# EAGLE design DA16200_Thing_Plus (EAGLE 9.6.2)
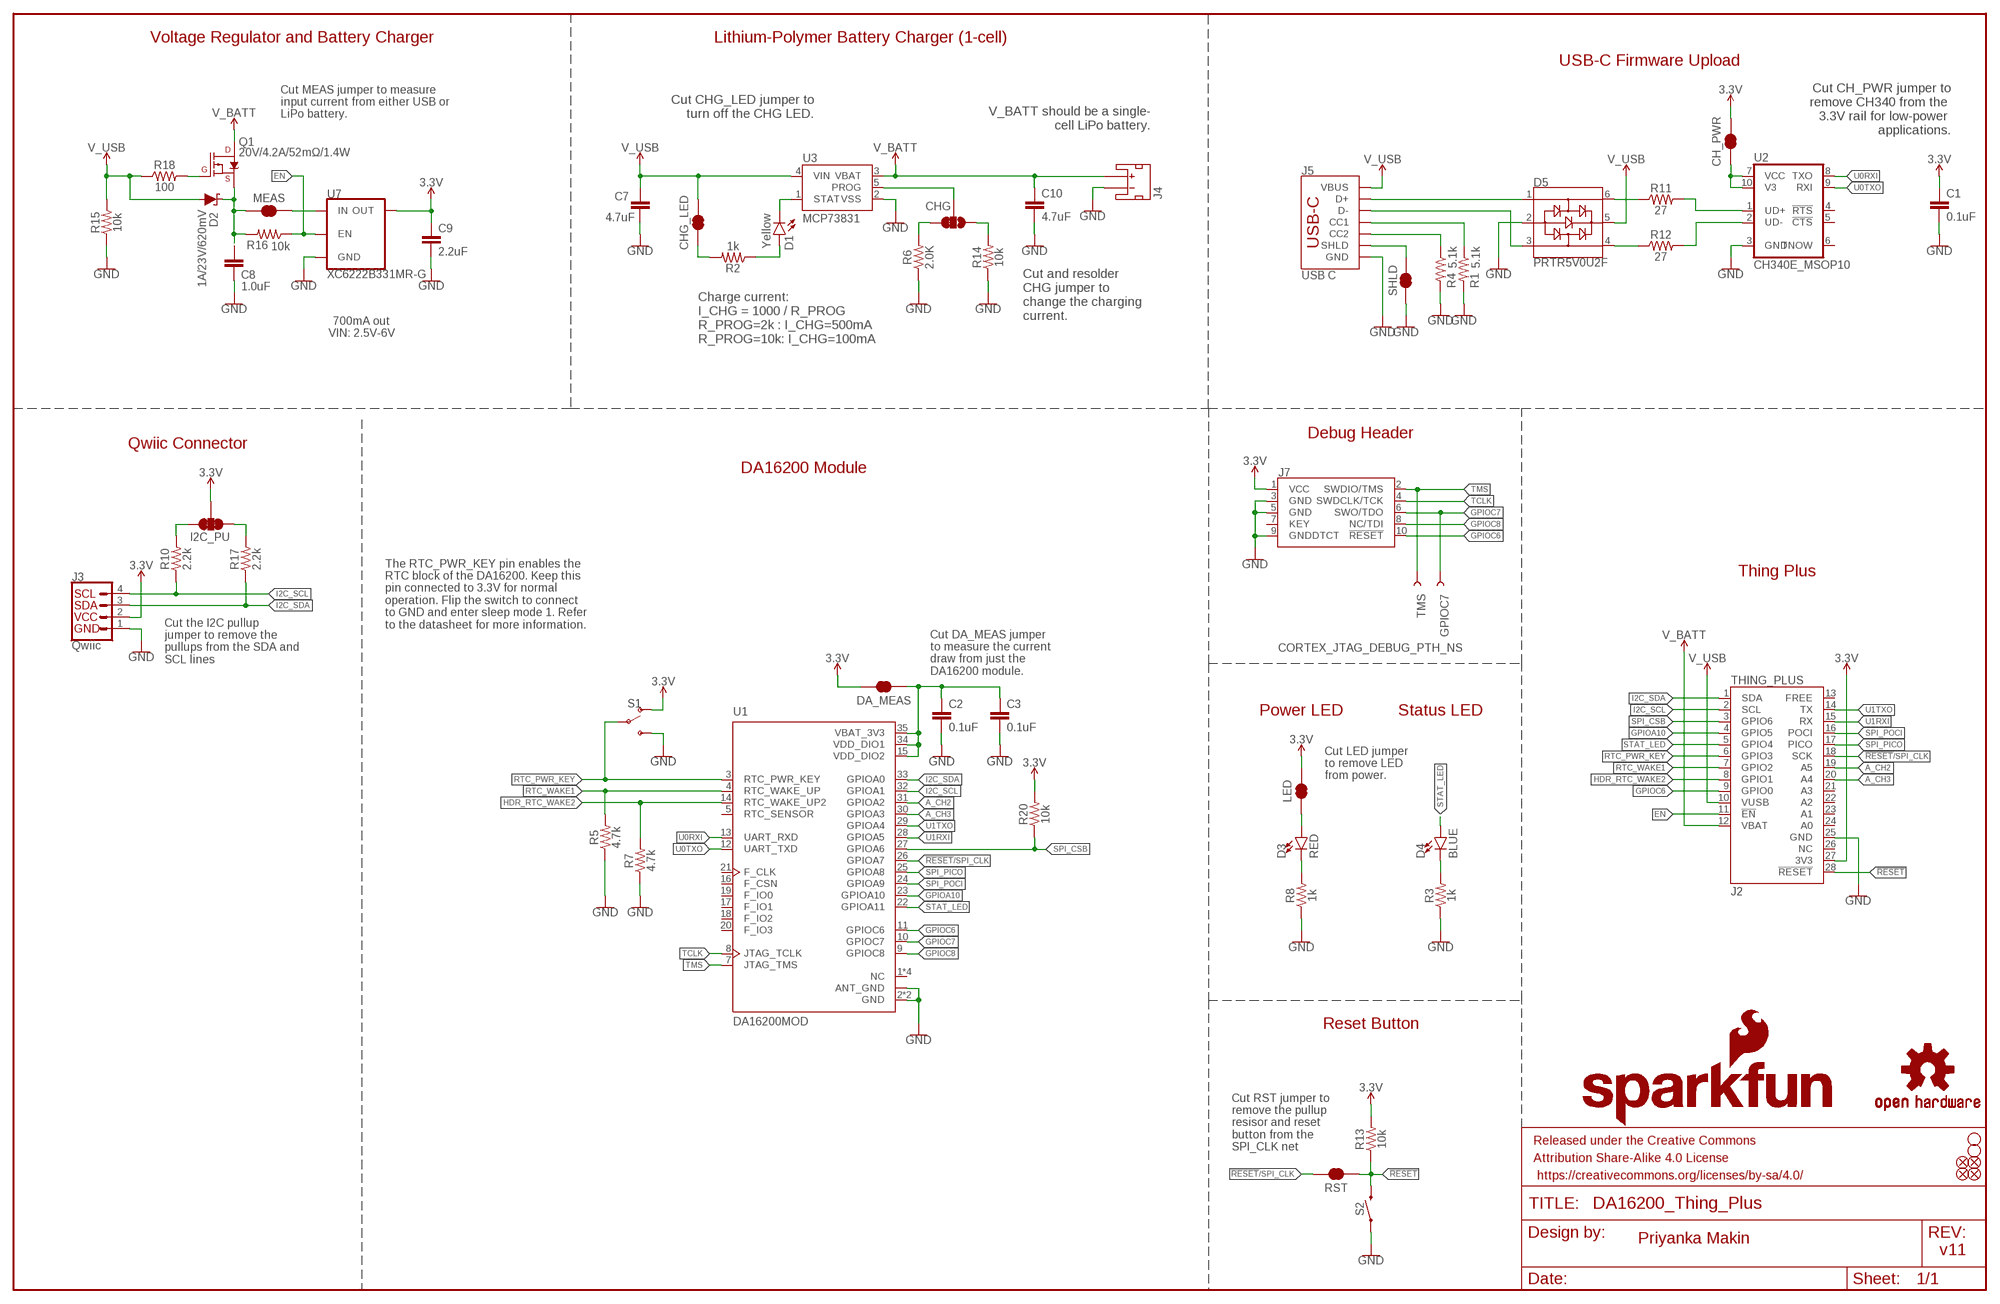
[diagram p0: schematic, sheet 1]

## Parts
C1  0.1uF  0.1UF-0402T-16V-10%  [0402-TIGHT]
C2  0.1uF  0.1UF-0402T-16V-10%  [0402-TIGHT]
C3  0.1uF  0.1UF-0402T-16V-10%  [0402-TIGHT]
C7  4.7uF  4.7UF-0402_TIGHT-6.3V-20%-X5R  [0402-TIGHT]
C8  1.0uF  1.0UF-0402T-16V-10%  [0402-TIGHT]
C9  2.2uF  2.2UF-0402_TIGHT-10V-10%-X5R  [0402-TIGHT]
C10  4.7uF  4.7UF-0402_TIGHT-6.3V-20%-X5R  [0402-TIGHT]
CH_PWR  JUMPER-SMT_2_NC_TRACE_SILK  [SMT-JUMPER_2_NC_TRACE_SILK]
CHG  JUMPER-SMT_3_1-NC_TRACE_SILK  [SMT-JUMPER_3_1-NC_TRACE_SILK]
CHG_LED  JUMPER-SMT_2_NC_TRACE_SILK  [SMT-JUMPER_2_NC_TRACE_SILK]
D1  Yellow  LED-YELLOW0603  [LED-0603]
D2  1A/23V/620mV  DIODE-SCHOTTKY-BAT20J  [SOD-323]
D3  RED  LED-RED0603  [LED-0603]
D4  BLUE  LED-BLUE0603  [LED-0603]
D5  PRTR5V0U2F  [SOT886]
DA_MEAS  JUMPER-SMT_2_NC_TRACE_SILK  [SMT-JUMPER_2_NC_TRACE_SILK]
FD1  FIDUCIALUFIDUCIAL  [FIDUCIAL-MICRO]
FD2  FIDUCIALUFIDUCIAL  [FIDUCIAL-MICRO]
FD3  FIDUCIALUFIDUCIAL  [FIDUCIAL-MICRO]
FD4  FIDUCIALUFIDUCIAL  [FIDUCIAL-MICRO]
FRAME1  FRAME-LEDGER  [CREATIVE_COMMONS]
GPIOC7  TEST-POINT3  [PAD.03X.03]
H3  STAND-OFF  [STAND-OFF]
H4  STAND-OFF  [STAND-OFF]
I2C_PU  JUMPER-SMT_3_2-NC_TRACE_SILK  [SMT-JUMPER_3_2-NC_TRACE_SILK]
J2  THING_PLUS  [THING_PLUS]
J3  Qwiic  QWIIC_CONNECTORJS-1MM  [JST04_1MM_RA]
J4  JST_2MM_MALE  [JST-2-SMD]
J5  USB C  USB_C_4-LAYER-ISOLATED  [USB-C-16P-4LAYER-ISOLATED]
J7  CORTEX_JTAG_DEBUG_PTH_NS  [2X5-PTH-1.27MM-NO_SILK]
LED  JUMPER-SMT_2_NC_TRACE_SILK  [SMT-JUMPER_2_NC_TRACE_SILK]
LOGO1  OSHW-LOGOS  [OSHW-LOGO-S]
LOGO2  SFE_LOGO_NAME_FLAME.1_INCH  [SFE_LOGO_NAME_FLAME_.1]
MEAS  JUMPER-COMBO_2_NC_TRACE  [COMBO-JUMPER_2_NC_TRACE]
Q1  20V/4.2A/52mΩ/1.4W  MOSFET_PCH-DMG2305UX-7  [SOT23-3]
R1  5.1k  5.1KOHM-0402T-1/16W-1%  [0402-TIGHT]
R2  1k  1KOHM-0402T-1/16W-1%  [0402-TIGHT]
R3  1k  1KOHM-0402T-1/16W-1%  [0402-TIGHT]
R4  5.1k  5.1KOHM-0402T-1/16W-1%  [0402-TIGHT]
R5  4.7k  4.7KOHM-0402T-1/16W-1%  [0402-TIGHT]
R6  2.0K  2.0KOHM-0402T-1/16W-1%  [0402-TIGHT]
R7  4.7k  4.7KOHM-0402T-1/16W-1%  [0402-TIGHT]
R8  1k  1KOHM-0402T-1/16W-1%  [0402-TIGHT]
R10  2.2k  2.2KOHM-0402T-1/16W-1%  [0402-TIGHT]
R11  27  27OHM  [0402-TIGHT]
R12  27  27OHM  [0402-TIGHT]
R13  10k  10KOHM-0402T-1/16W-1%  [0402-TIGHT]
R14  10k  10KOHM-0402T-1/16W-1%  [0402-TIGHT]
R15  10k  10KOHM-0402T-1/16W-1%  [0402-TIGHT]
R16  10k  10KOHM-0402T-1/16W-1%  [0402-TIGHT]
R17  2.2k  2.2KOHM-0402T-1/16W-1%  [0402-TIGHT]
R18  100  100OHM-0402-TIGHT-1/16W-1%  [0402-TIGHT]
R20  10k  10KOHM-0402T-1/16W-1%  [0402-TIGHT]
RST  JUMPER-SMT_2_NC_TRACE_SILK  [SMT-JUMPER_2_NC_TRACE_SILK]
S1  SWITCH-SPDT-SMD-AYZ0202  [SWITCH_DPDT_SMD_AYZ0202]
S2  MOMENTARY-SWITCH-SPST-SMD-5.2MM-TALL  [TACTILE_SWITCH_SMD_5.2MM]
SHLD  JUMPER-SMT_2_NC_TRACE_SILK  [SMT-JUMPER_2_NC_TRACE_SILK]
TMS  TEST-POINT3  [PAD.03X.03]
U1  DA16200MOD  DA16200MOD-AAC4WA32  [XCVR_DA16200MOD-AAC4WA32]
U2  CH340E_MSOP10  [MSOP10]
U3  MCP73831  [SOT23-5]
U7  XC6222B331MR-G  [SOT23-5]

## Nets
3.3V: C1.1 C9.1 CH_PWR.2 DA_MEAS.2 I2C_PU.2 J2.27(3V3) J3.2 J7.1(VCC) LED.2 R13.2 R20.2 S1.1(O) U7.5(OUT)
!RESET!: J2.28(!RESET) R13.1 RST.1 S2.3
!RESET!/SPI_CLK: J2.18(SCK) RST.2 U1.26(GPIOA7)
A_CH2: J2.19(A5) U1.31(GPIOA2)
A_CH3: J2.20(A4) U1.30(GPIOA3)
EN: J2.11(!EN) R16.1 U7.3(EN)
GND: C1.2 C2.2 C3.2 C7.2 C8.2 C9.2 C10.2 D5.2 J2.25(GND) J3.1 J4.1(-) J5.GND J5.GND2(GND) J7.3(GND) J7.5(GND) J7.9(GNDDTCT) R1.2 R3.1 R4.2 R5.1 R6.1 R7.1 R8.1 R14.1 R15.1 S1.3(S) S2.1 SHLD.1 U1.2(GND) U1.ANT_GND U1.GND U2.3(GND) U3.2(VSS) U7.2(GND)
GPIOA10: J2.4(GPIO5) U1.23(GPIOA10)
GPIOC6: J2.9(GPIO0) J7.10(!RESET) U1.11(GPIOC6)
GPIOC7: GPIOC7.1 J7.6(SWO/TDO) U1.10(GPIOC7)
GPIOC8: J7.8(NC/TDI) U1.9(GPIOC8)
HDR_RTC_WAKE2: J2.8(GPIO1) R7.2 U1.14(RTC_WAKE_UP2)
I2C_SCL: J2.2(SCL) J3.4 R10.1 U1.32(GPIOA1)
I2C_SDA: J2.1(SDA) J3.3 R17.1 U1.33(GPIOA0)
N$1: D4.C R3.2
N$2: I2C_PU.3 R10.2
N$3: I2C_PU.1 R17.2
N$4: D3.A LED.1
N$5: D5.1 J5.A6(D+) J5.B6(D+)
N$6: D5.3 J5.A7(D-) J5.B7(D-)
N$7: D3.C R8.2
N$8: C2.1 C3.1 DA_MEAS.1 U1.15(VDD_DIO2) U1.34(VDD_DIO1) U1.35(VBAT_3V3)
N$9: D1.C U3.1(STAT)
N$10: CHG.3 R6.2
N$11: J5.A5(CC1) R1.1
N$12: J5.B5(CC2) R4.1
N$13: D5.6 R11.1
N$14: CHG.2 U3.5(PROG)
N$15: C8.1 D2.C MEAS.1 MEAS.3 Q1.2(S) R16.2
N$16: D5.4 R12.1
N$17: D1.A R2.1
N$18: R11.2 U2.1(UD+)
N$19: R12.2 U2.2(UD-)
N$20: CHG.1 R14.2
N$21: Q1.1(G) R18.2
N$22: MEAS.2 MEAS.4 U7.1(IN)
N$23: CHG_LED.1 R2.2
N$24: J5.SHLD1(SHLD) J5.SHLD2(SHLD) J5.SHLD3(SHLD) J5.SHLD4(SHLD) J5.SHLD5(SHLD) J5.SHLD6(SHLD) J5.SHLD7(SHLD) J5.SHLD8(SHLD) SHLD.2
N$26: CH_PWR.1 U2.7(VCC) U2.10(V3)
RTC_PWR_KEY: J2.6(GPIO3) S1.2(P) U1.3(RTC_PWR_KEY)
RTC_WAKE1: J2.7(GPIO2) R5.2 U1.4(RTC_WAKE_UP)
SPI_CSB: J2.3(GPIO6) R20.1 U1.27(GPIOA6)
SPI_PICO: J2.17(PICO) U1.25(GPIOA8)
SPI_POCI: J2.16(POCI) U1.24(GPIOA9)
STAT_LED: D4.A J2.5(GPIO4) U1.22(GPIOA11)
TCLK: J7.4(SWDCLK/TCK) U1.8(JTAG_TCLK)
TMS: J7.2(SWDIO/TMS) TMS.1 U1.7(JTAG_TMS)
U0RXI: U1.13(UART_RXD) U2.8(TXO)
U0TXO: U1.12(UART_TXD) U2.9(RXI)
U1RXI: J2.15(RX) U1.28(GPIOA5)
U1TXO: J2.14(TX) U1.29(GPIOA4)
V_BATT: C10.1 J2.12(VBAT) J4.2(+) Q1.3(D) U3.3(VBAT)
V_USB: C7.1 CHG_LED.2 D2.A D5.5 J2.10(VUSB) J5.VBUS1(VBUS) J5.VBUS2(VBUS) R15.2 R18.1 U3.4(VIN)
Unconnected: J2.13(FREE) J2.21(A3) J2.22(A2) J2.23(A1) J2.24(A0) J2.26(NC) J4.NC1(PAD1) J4.NC2(PAD2) J7.7(KEY) U1.1(NC) U1.5(RTC_SENSOR) U1.6(NC) U1.16(F_CSN) U1.17(F_IO1) U1.18(F_IO2) U1.19(F_IO0) U1.20(F_IO3) U1.21(F_CLK) U1.36(NC) U1.37(NC) U2.4(!RTS) U2.5(!CTS) U2.6(TNOW)

## Notes on the sheet
- Voltage Regulator and Battery Charger | Lithium-Polymer Battery Charger (1-cell)
- USB-C Firmware Upload
- Cut CH_PWR jumper to
  remove CH340 from the 
  3.3V rail for low-power 
  applications.
- Cut CHG_LED jumper to
  turn off the CHG LED.
- V_BATT should be a single-
  cell LiPo battery.
- Cut MEAS jumper to measure
  input current from either USB or 
  LiPo battery.
- Cut and resolder
  CHG jumper to 
  change the charging
  current.
- Charge current:
  I_CHG = 1000 / R_PROG
  R_PROG=2k : I_CHG=500mA
  R_PROG=10k: I_CHG=100mA
- 700mA out
  VIN: 2.5V-6V
- Debug Header
- Qwiic Connector
- DA16200 Module
- Thing Plus
- The RTC_PWR_KEY pin enables the 
  RTC block of the DA16200. Keep this 
  pin connected to 3.3V for normal 
  operation. Flip the switch to connect 
  to GND and enter sleep mode 1. Refer 
  to the datasheet for more information.
- Cut the I2C pullup 
  jumper to remove the 
  pullups from the SDA and 
  SCL lines
- Cut DA_MEAS jumper
  to measure the current
  draw from just the
  DA16200 module.
- Power LED | Status LED
- Cut LED jumper
  to remove LED
  from power.
- Reset Button
- Cut RST jumper to
  remove the pullup
  resisor and reset
  button from the
  SPI_CLK net
- Priyanka Makin
- v11

## Library data of the parts
C1-C3 = SparkFun-Capacitors:0.1UF: 0.1µF ceramic capacitors A capacitor is a passive two-terminal electrical component used to store electrical energy temporarily in an electric field.; PROD_ID: CAP-12416
C7 C10 = SparkFun-Capacitors:4.7UF: 4.7µF ceramic capacitors A capacitor is a passive two-terminal electrical component used to store electrical energy temporarily in an electric field.; PROD_ID: CAP-14240
C8 = SparkFun-Capacitors:1.0UF: 1µF ceramic capacitors A capacitor is a passive two-terminal electrical component used to store electrical energy temporarily in an electric field.; PROD_ID: CAP-12417
C9 = SparkFun-Capacitors:2.2UF: 2.2µF ceramic capacitors A capacitor is a passive two-terminal electrical component used to store electrical energy temporarily in an electric field.; PROD_ID: CAP-14232
CH_PWR CHG_LED DA_MEAS LED RST SHLD = SparkFun-Jumpers:JUMPER-SMT_2_NC_TRACE: Normally closed trace jumper This jumper has a trace between two pads so it's normally closed (NC). Use a razor knife to open the connection. For best results follow the IPC guidelines for cutting traces: Cutout at least 0.063 mm (0.005 in). Remove all loose material to clean up the cut area. Seal the cut with an approved epoxy. Reapply solder to reclose the connection.
CHG = SparkFun-Jumpers:JUMPER-SMT_3_1-NC_TRACE: Normally closed trace jumper (1 of 2 connections) This jumper has a trace between two pads so it's normally closed (NC). The other connection is normally open (NO). Use a razor knife to open the connection. For best results follow the IPC guidelines for cutting traces: Cutout at least 0.063 mm (0.005 in). Remove all loose material to clean up the cut area. Seal the cut with an approved epoxy. Reapply solder to reclose the connection, or to close the NO connection.
D1 = SparkFun-LED:LED-YELLOW: Yellow SMD LED Used in manufacturing several products at SparkFun. Packages: 0603 - SMD 0603 package[Product Link] <http://www.kingbrightusa.com/product.asp?catalog_name=LED&product_id=APT1608SYCK> 0603 -SMART - SMART SMD 0603 package (more efficient/more expensive) [Product Link] <http://www.osram-os.com/osram_os/en/products/product-catalog/led-light-emitting-diodes/smartled-0603/ly-l29k/index.jsp> LilyPad - SMD1206 package[Product Datasheet] <https://www.sparkfun.com/datasheets/DevTools/LilyPad/Q150YUS4.pdf> SparkFun Products: Blynk Board <https://www.sparkfun.com/products/13794> IOIO-OTG <https://www.sparkfun.com/products/13613> XBee Explorer Serial <https://www.sparkfun.com/products/13225>; PROD_ID: DIO-09003
D2 = SparkFun-DiscreteSemi:DIODE-SCHOTTKY: Schottky diode A Schottky diode is a semiconductor diode which has a low forward voltage drop and a very fast switching action.; PROD_ID: DIO-11623
D3 = SparkFun-LED:LED-RED: Red SMD LED Used in manufacturing of most products at SparkFun Packages: 0603 - SMD 0603 package [Product Link] <http://docs.avagotech.com/docs/AV02-0551EN> 0603 SMART - SMD 0603 SMART package ( more efficient and expensive)[Product Link] <http://www.osram-os.com/Graphics/XPic2/00077099_0.pdf> 1206 - SMD1206 package [Product Link] <https://www.sparkfun.com/datasheets/DevTools/LilyPad/Q150OVS4.pdff> SparkFun Products: Pro Mini 328 -5V <https://www.sparkfun.com/products/821> RedBoard <https://www.sparkfun.com/products/12757> IOIO-OTG <https://www.sparkfun.com/products/13613>; PROD_ID: DIO-00819
D4 = SparkFun-LED:LED-BLUE: Blue SMD LED Used in manufacturing of various products at SparkFun Packages: 0603 - SMD 0603 package [Product Link] <http://www.digikey.com/product-detail/en/SMLE12BC7TT86/511-1589-2-ND/1641808> 1206 - SMD1206 package [Product Link] <http://www.digikey.com/product-detail/en/lite-on-inc/LTST-C150TBKT/160-1643-1-ND/573584> SparkFun Products: ESP8266 Thing-Dev Board <https://www.sparkfun.com/products/13711> RedBoard <https://www.sparkfun.com/products/12757>; PROD_ID: DIO-08575
D5 = SparkFun-IC-Power:PRTR5V0U2: A small ESD protection device. Most commonly used on USB D+/D- signals to protect large, expensive, or especially sensitive USB enabled devices.; PROD_ID: DIO-14084
FD1-FD4 = SparkFun-Aesthetics:FIDUCIAL: Fiducial Alignment Points Point-of-reference for pick-and-place machines and other optical instruments.
FRAME1 = SparkFun-Aesthetics:FRAME-LEDGER: Schematic Frame - Ledger Standard 11x14 US Ledger frame
GPIOC7 TMS = SparkFun-Connectors:TEST-POINT: SparkFun Test Points Bare copper test points for troubleshooting or In-Circuit-Testing. These are used by our Production team for verifying production board runs using pogo-pins on test beds. SparkFun Products: SparkFun LSM9DS1 Breakout <https://www.sparkfun.com/products/13284> SparkFun PSOC <https://www.sparkfun.com/products/13714> SparkFun Load Cell Amplifier <https://www.sparkfun.com/products/13879>
H3 H4 = SparkFun-Hardware:STAND-OFF: Stand Off Drill holes for mechanically mounting via screws, standoffs, etc. Note: Use the keepout ring to avoid running the screw head into surrounding components. Variant Overviews STAND-OFF - Mechanical footprint for a #4 phillips button head screw. STAND-OFF-TIGHT - Mechanical footprint for a #4 phillips button head screw, Example SparkFun Products Screw - Phillips Head (1/4", 4-40, 10 pack) (PRT-10453) Screw - Phillips Head (1/2", 4-40, 10 pack) (PRT-10452) Screw - Phillips Head (3/4", 4-40, 10 pack) (PRT-10451) Screw - Phillips Head (1", 4-40, 10 pack) (PRT-10450)
I2C_PU = SparkFun-Jumpers:JUMPER-SMT_3_2-NC_TRACE: Normally closed trace jumper (2 of 2 connections) This jumper has a trace between all three pads so they are normally closed (NC). Use a razor knife to open the connection(s). For best results follow the IPC guidelines for cutting traces: Cutout at least 0.063 mm (0.005 in). Remove all loose material to clean up the cut area. Seal the cut with an approved epoxy. Reapply solder to reclose the connection(s).
J2 = SparkFun-Boards:THING_PLUS
J3 = SparkFun-Connectors:QWIIC_CONNECTOR: SparkFun I2C Standard Qwiic Connector An SMD 1mm pitch JST connector makes it easy and quick (get it? Qwiic?) to connect I2C devices to each other. The Qwiic system <http://www.sparkfun.com/qwiic> enables fast and solderless connection between popular platforms and various sensors and actuators. We carry 200mm <https://www.sparkfun.com/products/14204>, 100mm <https://www.sparkfun.com/products/14205>, 50mm <https://www.sparkfun.com/products/14206>, and breadboard friendly <https://www.sparkfun.com/products/14207> Qwiic cables. We also offer 10 pcs strips <https://www.sparkfun.com/products/14323> the SMD connectors.; PROD_ID: CONN-13694; VALUE: QWIIC_RIGHT_ANGLE
J4 = SparkFun-Connectors:JST_2MM_MALE: JST 2MM MALE RA CONNECTOR Two pin, compact surface mount connector. Commonly used as a battery input connection point. We really like the solid locking feeling and high current rating on these small connectors. We use these all the time as battery connectors. Mates to single-cell LiPo batteries. Here is the connector we sell at SparkFun: JST Right Angle Connector - White (PRT-08612) Datasheet It was used on these SparkFun products: SparkFun MOSFET Power Controller (PRT-11214) SparkFun Battery Babysitter - LiPo Battery Manager (PRT-13777) And many, many others that required a lipo battery connection.; PROD_ID: CONN-11443; SF_ID: PRT-08612
J5 = SparkFun-Connectors:USB_C: USB Type C 16Pin Connector Super Speed pins not available on the 16-pin purely SMD connector so this part is best for USB 2.0 implementations. D1 and D2 are tied together enabling D+/- no matter which way the cable is plugged into the connector. The two channel configuration pins (CC1/2) are exposed. These are normally connected to ground via 5.1k resistors but can be reconfigured for high current/high power applications. **4-LAYER BOARD WARNING!!** If designing 4-layer board, make sure to select the variant _4-LAYER-ISOLATED. The linked footprint (USB-C-16-4LAYER-ISOLATED) includes some very necessary cutout polygons in the inner layers (2 and 15). This prevents the PTH mounting shield legs on the USB connector from electrically connecting any other polygons on the inner layers (usually VCC and GND).; PROD_ID: CONN-14122; VALUE: USB Female Type C Connector
J7 = SparkFun-Connectors:CORTEX_JTAG_DEBUG: Cortex Debug Connector - 10 pin Supports JTAG debug, Serial Wire debug, and Serial Wire Viewer. PTH and SMD connector options available. General Connector Information <http://infocenter.arm.com/help/topic/com.arm.doc.faqs/attached/13634/cortex_debug_connectors.pdf> Products: PTH Connector <http://www.digikey.com/product-detail/en/cnc-tech/3220-10-0100-00/1175-1627-ND/3883661> -via Digi-Key SparkFun PSoc <https://www.sparkfun.com/products/13229> SparkFun T <https://www.sparkfun.com/products/13810>
LOGO1 = SparkFun-Aesthetics:OSHW-LOGO: Open-Source Hardware (OSHW) Logo This logo indicates the piece of hardware it is found on incorporates a OSHW license and/or adheres to the definition of open source hardware found here: http://freedomdefined.org/OSHW
LOGO2 = SparkFun-Aesthetics:SFE_LOGO_NAME_FLAME: SparkFun Font Logo w/ Flame This is the SparkFun full logo. The logo on the schematic will always be the same size; the package variant is the height of the flame part of the logo. Default layer for the logo on the board is tSilk.
MEAS = SparkFun-Jumpers:JUMPER-COMBO_2_NC_TRACE
Q1 = SparkFun-DiscreteSemi:MOSFET_PCH: P-channel MOSFETs Voltage controlled devices that allow control of high current outputs. SparkFun Products: SparkFun ESP32 Thing <https://www.sparkfun.com/products/13907> SparkFun ESP8266 Thing <https://www.sparkfun.com/products/13231> SparkFun Pi Servo HAT V2 <https://www.sparkfun.com/products/15316> DMG2305UX-7 (20V/4.2A/SOT23-3); PROD_ID: TRANS-14388
R1 R4 = SparkFun-Resistors:5.1KOHM; PROD_ID: RES-14340
R2 R3 R8 = SparkFun-Resistors:1KOHM: 1kΩ resistor A resistor is a passive two-terminal electrical component that implements electrical resistance as a circuit element. Resistors act to reduce current flow, and, at the same time, act to lower voltage levels within circuits. - Wikipedia; PROD_ID: RES-14342
R5 R7 = SparkFun-Resistors:4.7KOHM: 4.7kΩ resistor A resistor is a passive two-terminal electrical component that implements electrical resistance as a circuit element. Resistors act to reduce current flow, and, at the same time, act to lower voltage levels within circuits. - Wikipedia; PROD_ID: RES-15343
R6 = SparkFun-Resistors:2.0KOHM: 2kΩ resistor A resistor is a passive two-terminal electrical component that implements electrical resistance as a circuit element. Resistors act to reduce current flow, and, at the same time, act to lower voltage levels within circuits. - Wikipedia; PROD_ID: RES-15406
R10 R17 = SparkFun-Resistors:2.2KOHM: 2.2kΩ resistor A resistor is a passive two-terminal electrical component that implements electrical resistance as a circuit element. Resistors act to reduce current flow, and, at the same time, act to lower voltage levels within circuits. - Wikipedia; PROD_ID: RES-14341
R11 R12 = SparkFun-Resistors:27OHM: 27Ω resistor A resistor is a passive two-terminal electrical component that implements electrical resistance as a circuit element. Resistors act to reduce current flow, and, at the same time, act to lower voltage levels within circuits. - Wikipedia; PROD_ID: RES-15238
R13-R16 R20 = SparkFun-Resistors:10KOHM: 10kΩ resistor A resistor is a passive two-terminal electrical component that implements electrical resistance as a circuit element. Resistors act to reduce current flow, and, at the same time, act to lower voltage levels within circuits. - Wikipedia; PROD_ID: RES-14241
R18 = SparkFun-Resistors:100OHM: 100Ω resistor A resistor is a passive two-terminal electrical component that implements electrical resistance as a circuit element. Resistors act to reduce current flow, and, at the same time, act to lower voltage levels within circuits. - Wikipedia; PROD_ID: RES-14962
S1 = SparkFun-Switches:SWITCH-SPDT: Single Pole, Double Throw (SPDT) Switch Single-pole, double-throw (SPDT) switch. Variant Overview SMD-AYZ0202 Surface Mount DPDT Switch (COM-00597) Used on e.g. LilyPad Arduino USB - ATmega32U4 Board PTH-11.6X4.0MM SPDT Mini Power Switch (COM-00102) Used on e.g. SparkFun Simon Says - Through-Hole Soldering Kit (KIT-10547) PTH-11.6X4.0MM-KIT KIT version of SPDT Mini Power Switch - Simplifies soldering by removing tStop of switch pins - only one side can be soldered. PTH-11.6X4.0MM-LOCK LOCK version of SPDT Mini Power Switch - Offset pins hold switch in place for easier soldering. SMD-RIGHT-ANGLE Surface Mount Right Angle Switch (COM-10860) Used on e.g. SparkFun ESP8266 Thing; PROD_ID: SWCH-08179; SF_ID: COM-00597
S2 = SparkFun-Switches:MOMENTARY-SWITCH-SPST: Momentary Switch (Pushbutton) - SPST Normally-open (NO) SPST momentary switches (buttons, pushbuttons). Variants PTH-12MM - 12mm square, through-hole Momentary Pushbutton Switch - 12mm Square (COM-09190) PTH-6.0MM, PTH-6.0MM-KIT - 6.0mm square, through-hole Mini Pushbutton Switch (COM-00097) KIT package intended for soldering kit's - only one side of pads' copper is exposed. PTH-RIGHT-ANGLE-KIT - Right-angle, through-hole Right Angle Tactile Button - Used on SparkFun BigTime Watch Kit SMD-12MM - 12mm square, surface-mount Tactile Button - SMD (12mm) (COM-12993) Used on SparkFun PicoBoard SMD-4.5MM - 4.5mm Square Trackball Switch Used on SparkFun Blackberry Trackballer Breakout SMD-4.6MMX2.8MM - 4.60mm x 2.80mm, surface mount Used on SparkFun Pro Micro - RP2040 SMD-5.2MM, SMD-5.2-REDUNDANT - 5.2mm square, surface-mount Mini Pushbutton Switch - SMD (COM-08720) Used on Arduino Pro Mini REDUNDANT package connects both switch circuits together SMD-6.0X3.5MM - 6.0 x 3.5mm, surface mount Momentary Reset Switch SMD (COM-08229) SMD-6.2MM-TALL - 6.2mm square, surface mount Tactile Button - SMD (6mm) Used on SparkFun Digital Sandbox SMD-RIGHT-ANGLE - Right-angle, surface mount Used on SparkFun Block for Intel® Edison - Arduino; PROD_ID: SWCH-14139
U1 = SparkFun-RF:DA16200MOD-AAC4WA32: Check prices; PROD_ID: IC-16179
U2 = SparkFun-IC-Comms:CH340E; PROD_ID: IC-14135
U3 = SparkFun-IC-Power:MCP73831: MCP73831T Li-Ion, Li-Pol Controller Miniature single cell, fully integrated Li-Ion, Li-polymer charge management controller Datasheet <http://ww1.microchip.com/downloads/en/DeviceDoc/20001984g.pdf> SparkFun Products: SparkFun ESP32 Thing <https://www.sparkfun.com/products/13907> SparkFun 9DoF Razor IMU M0 <https://www.sparkfun.com/products/14001>; PROD_ID: IC-09995
U7 = SparkFun-IC-Power:XC6222; IOUT: 700mA; PROD_ID: VREG-16775; VOUT: 3.3V

## Net classes
0 default: width 0 mm, drill 0 mm
2 Clock: width 0.089 mm, clearance 0.178 mm

## Board
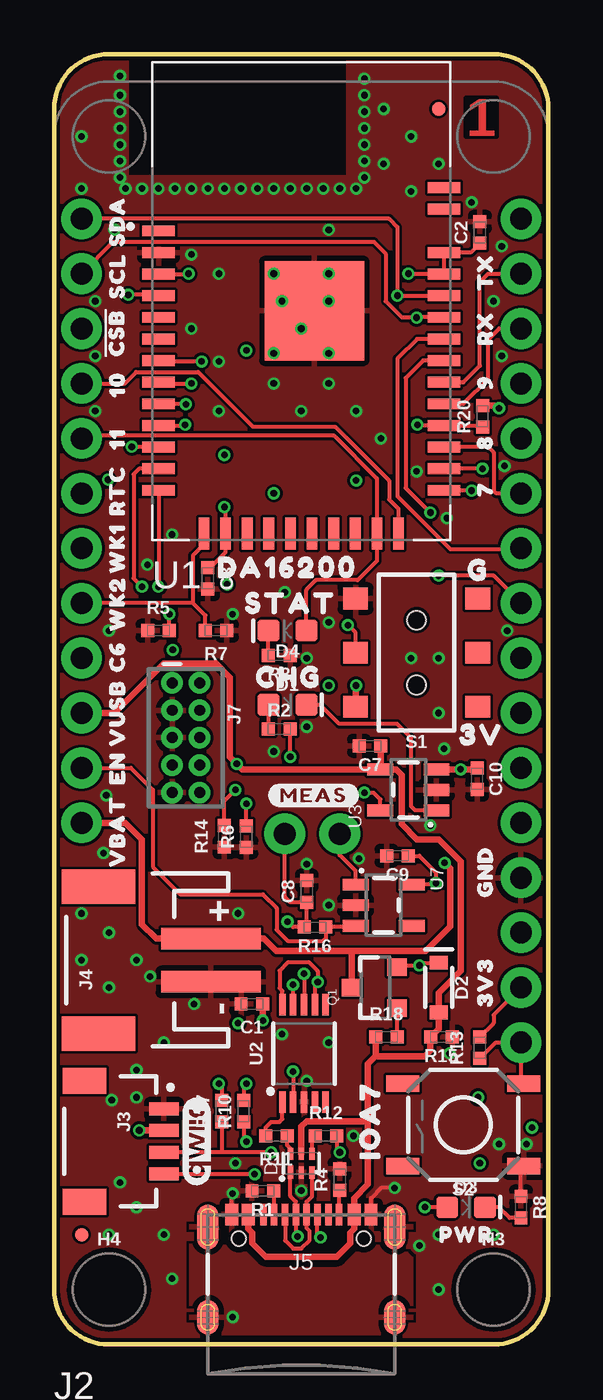
[diagram p1: board, top side]
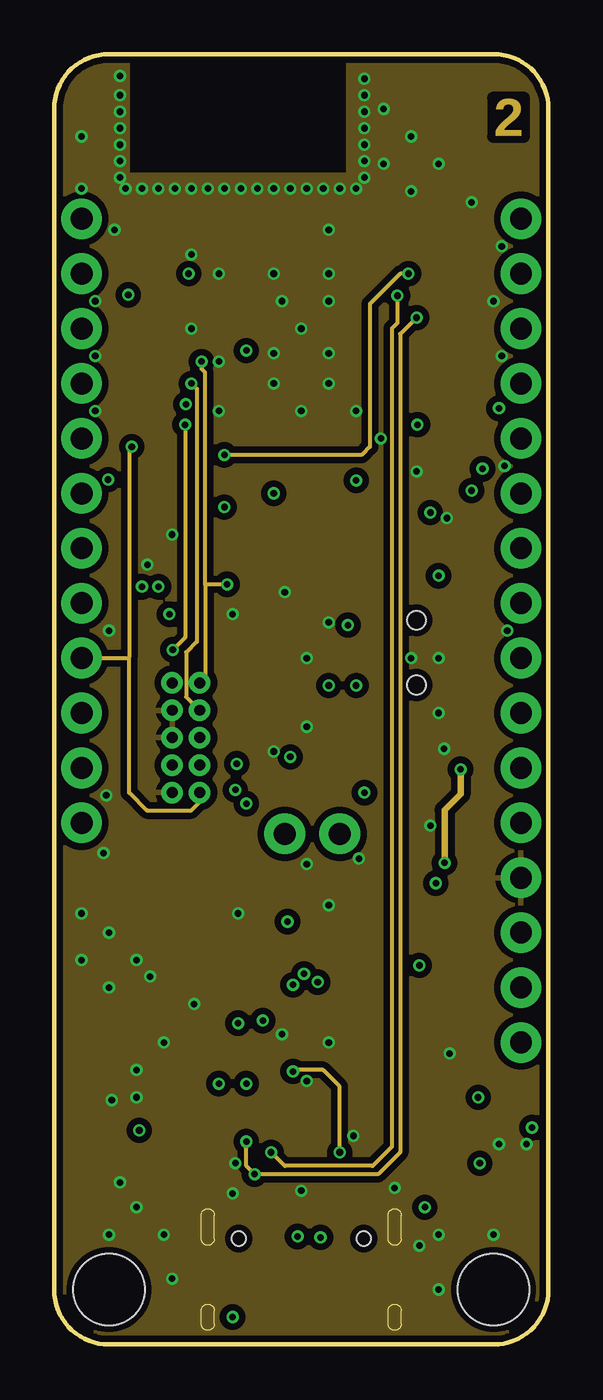
[diagram p2: board, inner layer gndvert]
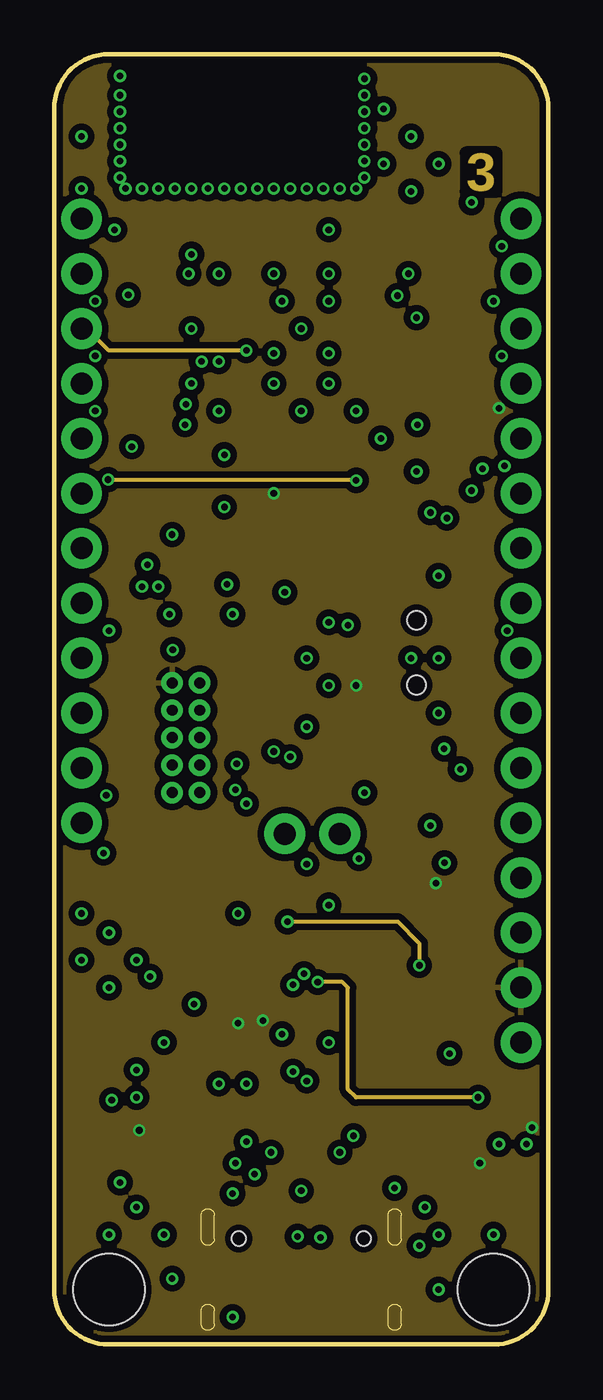
[diagram p3: board, inner layer pwrhorz]
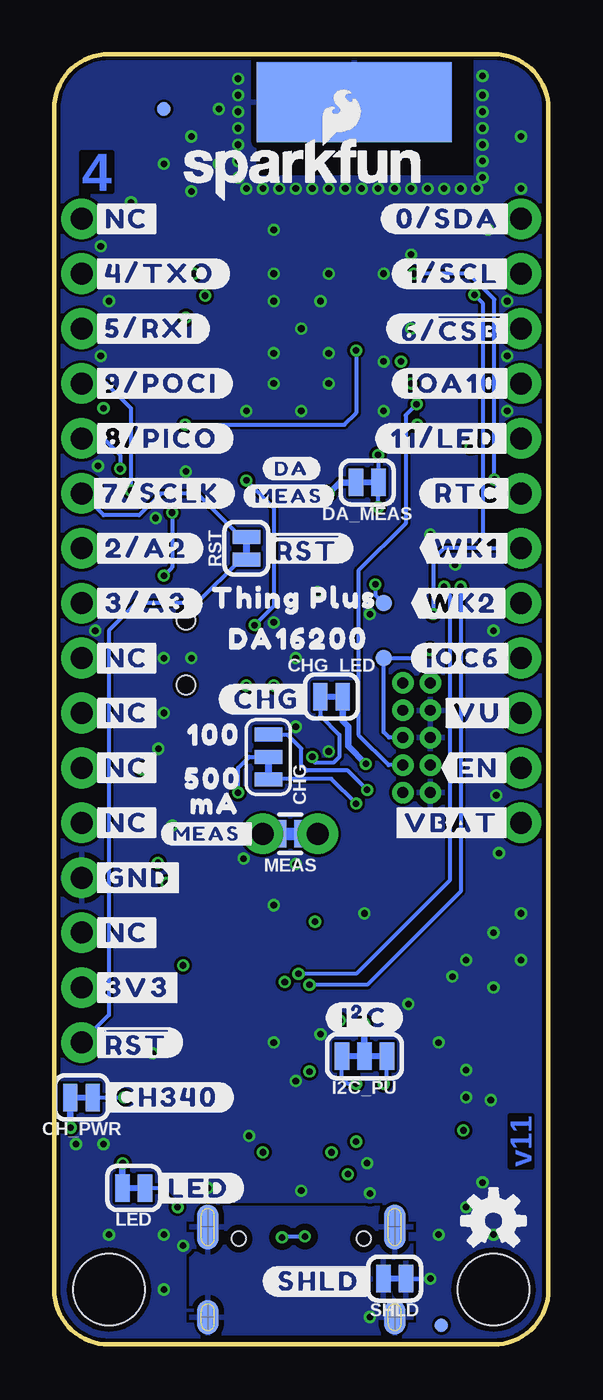
[diagram p4: board, bottom side, seen from below]

Size 22.86 x 59.69 mm. Coordinates in mm from the lower left corner, seen from the top.
Outline: 2.54,59.69 20.32,59.69 arc-90 22.86,57.15 22.86,2.54 arc-90 20.32,0 2.54,0 arc-90 0,2.54 0,57.15 arc-90 2.54,59.69
Copper layers (1*2*15*16): Top 0.035559375mm / dielectric 0.47751875mm / gndvert 0.035559375mm / dielectric 0.47751875mm / pwrhorz 0.035559375mm / dielectric 0.47751875mm / Bottom 0.035559375mm
Design rules "SparkFun-4-Layer-Minimum-JLCPCB": minimum track width 5mil, minimum drill 0.2mm, track to track 5mil, track to pad 5mil, pad to pad 5mil, via to via 5mil, smd to smd 5mil, copper to edge 7mil, drill to drill 7mil, minimum pad ring 5mil, minimum via ring 5mil, stop-mask expansion 2.5mil, vias tented up to drill 25mil, thermal gap 10mil

### Footprints (pad centres in the part's own frame; a part is rotated, then mirrored left to right if it is on the bottom)
0402-TIGHT = smd 0.6 x 0.6: 1 -0.5,0; 2 0.5,0
SMT-JUMPER_2_NC_TRACE_SILK = smd 0.66 x 1.27: 1 -0.521,0; 2 0.521,0
SMT-JUMPER_3_1-NC_TRACE_SILK = smd 0.66 x 1.27: 1 -1.041,0; 2 0,0; 3 1.041,0
LED-0603 = smd 1 x 1: A -0.877,0; C 0.877,0
SOD-323 = smd 0.63 x 0.83: A 1.15,0; C -1.15,0
SOT886 = smd 0.61 x 0.25: 1 -0.405,0.5 | smd 0.56 x 0.25: 2 -0.43,0; 3 -0.43,-0.5; 4 0.43,-0.5; 5 0.43,0; 6 0.43,0.5
FIDUCIAL-MICRO = smd 0.635 x 0.635: 1 0,0
PAD.03X.03 = smd 0.762 x 0.762: 1 0,0
STAND-OFF = hole 3.302: 0,0
SMT-JUMPER_3_2-NC_TRACE_SILK = smd 0.66 x 1.27: 1 -1.041,0; 2 0,0; 3 1.041,0
THING_PLUS = drill 1.016 pad 1.88: 1 1.27,52.07; 2 1.27,49.53; 3 1.27,46.99; 4 1.27,44.45; 5 1.27,41.91; 6 1.27,39.37; 7 1.27,36.83; 8 1.27,34.29; 9 1.27,31.75; 10 1.27,29.21; 11 1.27,26.67; 12 1.27,24.13; 13 21.59,52.07; 14 21.59,49.53; 15 21.59,46.99; 16 21.59,44.45; 17 21.59,41.91; 18 21.59,39.37; 19 21.59,36.83; 20 21.59,34.29; 21 21.59,31.75; 22 21.59,29.21; 23 21.59,26.67; 24 21.59,24.13; 25 21.59,21.59; 26 21.59,19.05; 27 21.59,16.51; 28 21.59,13.97
JST04_1MM_RA = smd 0.6 x 1.35: 1 -1.5,0; 2 -0.5,0; 3 0.5,0; 4 1.5,0 | smd 1.2 x 2: NC1 2.8,-3.675; NC2 -2.8,-3.675
JST-2-SMD = smd 1 x 4.6: 1 -1,-3.7; 2 1,-3.7 | smd 1.6 x 3.4: NC1 -3.4,1.5; NC2 3.4,1.5
USB-C-16P-4LAYER-ISOLATED = smd 0.3 x 1: A5 -1.25,-0.34; A6 -0.25,-0.34; A7 0.25,-0.34; A8 1.25,-0.34; B5 1.75,-0.34; B6 0.75,-0.34; B7 -0.75,-0.34; B8 -1.75,-0.34 | smd 0.6 x 1: GND -3.225,-0.34; GND2 3.225,-0.34; VBUS1 -2.45,-0.34; VBUS2 2.45,-0.34 | smd 1 x 2.1: SHLD1 -4.32,-0.915; SHLD2 4.32,-0.915 | smd 1 x 2.1 bottom: SHLD3 -4.32,-0.915; SHLD4 4.32,-0.915 | smd 1 x 1.6: SHLD5 -4.32,-5.095; SHLD8 4.32,-5.095 | smd 1 x 1.6 bottom: SHLD6 -4.32,-5.095; SHLD7 4.32,-5.095 | hole 0.65: -2.89,-1.445; 2.89,-1.445
2X5-PTH-1.27MM-NO_SILK = drill 0.508 pad 1: 1 -2.54,-0.635; 2 -2.54,0.635; 3 -1.27,-0.635; 4 -1.27,0.635; 5 0,-0.635; 6 0,0.635; 7 1.27,-0.635; 8 1.27,0.635; 9 2.54,-0.635; 10 2.54,0.635
COMBO-JUMPER_2_NC_TRACE = smd 0.635 x 1.27: 1 -0.508,0; 2 0.508,0 | drill 1.016 pad 1.88: 3 -1.27,0; 4 1.27,0
SOT23-3 = smd 0.8 x 0.9: 1 -0.95,-1; 2 0.95,-1; 3 0,1.1
SWITCH_DPDT_SMD_AYZ0202 = smd 1 x 1.15: 1 -2.5,2.825; 2 0,2.825; 3 2.5,2.825; 4 -2.5,-2.825; 5 0,-2.825; 6 2.5,-2.825 | hole 0.85: 1.5,0; -1.5,0
TACTILE_SWITCH_SMD_5.2MM = smd 1.524 x 0.762: 1 -2.794,1.905; 2 2.794,1.905; 3 -2.794,-1.905; 4 2.794,-1.905
XCVR_DA16200MOD-AAC4WA32 = smd 1.5 x 0.5: 1 -6.6,3.25; 2 -6.6,2.25; 3 -6.6,1.25; 4 -6.6,0.25; 5 -6.6,-0.75; 6 -6.6,-1.75; 7 -6.6,-2.75; 8 -6.6,-3.75; 9 -6.6,-4.75; 10 -6.6,-5.75; 11 -6.6,-6.75; 12 -6.6,-7.75; 13 -6.6,-8.75; 24 6.6,-8.75; 25 6.6,-7.75; 26 6.6,-6.75; 27 6.6,-5.75; 28 6.6,-4.75; 29 6.6,-3.75; 30 6.6,-2.75; 31 6.6,-1.75; 32 6.6,-0.75; 33 6.6,0.25; 34 6.6,1.25; 35 6.6,2.25; 36 6.6,4.25; 37 6.6,5.25 | smd 0.5 x 1.5: 14 -4.5,-10.75; 15 -3.5,-10.75; 16 -2.5,-10.75; 17 -1.5,-10.75; 18 -0.5,-10.75; 19 0.5,-10.75; 20 1.5,-10.75; 21 2.5,-10.75; 22 3.5,-10.75; 23 4.5,-10.75 | smd 9 x 3.7 bottom: ANT_GND -2.45,9.2 | smd 4.6 x 4.6: GND 0.61,-0.45
MSOP10 = smd 1 x 0.3: 1 -2.25,1; 2 -2.25,0.5; 3 -2.25,0; 4 -2.25,-0.5; 5 -2.25,-1; 6 2.25,-1; 7 2.25,-0.5; 8 2.25,0; 9 2.25,0.5; 10 2.25,1
SOT23-5 = smd 0.55 x 1.2: 1 -0.95,-1.3; 2 0,-1.3; 3 0.95,-1.3; 4 0.95,1.3; 5 -0.95,1.3

### Placement (x,y rotation side)
C1  9.14,15.75 180 top
C2  19.68,51.44 90 top
C3  7.11,35.43 270 top
C7  14.61,27.69 180 top
C8  11.68,20.95 90 top
C9  15.88,22.61 180 top
C10  19.56,26.16 270 top
CH_PWR  21.59,11.43 180 bottom
CHG  12.95,27.18 270 bottom
CHG_LED  10.03,29.97 0 bottom
D1  10.79,29.59 0 top
D2  17.78,16.51 270 top
D3  19.05,6.35 0 top
D4  10.79,33.02 180 top
D5  11.43,8.38 90 top
DA_MEAS  8.38,39.88 180 bottom
FD1  1.27,5.08 0 top
FD2  17.78,57.15 0 top
FD3  4.95,0.89 0 bottom
FD4  17.78,57.15 0 bottom
FRAME1  -17.14,-19.05 0 top  (outside the outline)
GPIOC7  7.62,31.75 0 bottom
H3  20.32,2.54 0 top
H4  2.54,2.54 0 top
I2C_PU  8.51,13.34 180 bottom
J2  0,0 0 top
J3  5.08,9.4 270 top
J4  3.56,17.78 90 top
J5  11.43,6.35 0 top
J7  6.1,28.07 270 top
LED  19.18,7.24 180 bottom
LOGO1  2.54,5.71 0 bottom
LOGO2  11.3,54.36 0 bottom
MEAS  11.94,23.62 180 bottom
Q1  14.86,16.51 90 top
R1  9.65,7.11 180 top
R2  10.41,28.47 0 top
R3  10.41,31.88 180 top
R4  13.21,7.62 90 top
R5  4.83,33.02 0 top
R6  8.89,23.5 90 top
R7  7.49,33.02 180 top
R8  21.59,6.35 270 top
R10  8.76,10.79 90 top
R11  10.28,9.65 180 top
R12  12.58,9.65 0 top
R13  19.68,13.72 90 top
R14  7.87,23.5 90 top
R15  17.91,14.22 180 top
R16  12.06,19.3 180 top
R17  7.75,10.79 90 top
R18  15.38,14.22 0 top
R20  19.81,42.93 90 top
RST  13.97,36.83 90 bottom
S1  16.76,32 90 top
S2  18.92,10.16 180 top
SHLD  7.11,3.05 180 bottom
TMS  7.62,34.29 0 bottom
U1  11.43,48.26 0 top
U2  11.56,13.46 90 top
U3  16.38,25.65 90 top
U7  15.24,20.32 270 top
U$1  [STAT0]  8.13,34.29 0 top
U$2  [CHG0]  8.64,30.86 0 top
U$3  [#MEAS_#0]  17.91,23.62 0 bottom
U$4  [G0]  18.41,35.81 0 top
U$5  [##RST##0]  21.21,13.97 0 bottom
U$6  [#VU#0]  5.08,29.21 0 bottom
U$7  [#IOA10#0]  7.24,44.45 0 bottom
U$8  [#MEAS#0]  9.91,25.4 0 top
U$9  [3V0]  18.03,28.19 0 top
U$10  [#CH340#0]  20.7,11.43 0 bottom
U$11  [#0#SDA#0]  7.75,52.07 0 bottom
U$12  [#1#SCL#0]  7.24,49.53 0 bottom
U$13  [IOA7_0]  14.61,7.87 90 top
U$14  [#NC#0]  21.21,31.75 0 bottom
U$15  [#NC#0]  21.21,29.21 0 bottom
U$16  [PWR0]  19.05,5.08 0 top
U$17  [#DA#0]  13.21,40.51 0 bottom
U$18  [#NC#0]  21.21,26.67 0 bottom
U$19  [#NC#0]  21.21,24.13 0 bottom
U$20  [#NC#0]  21.21,19.05 0 bottom
U$21  [5000]  17.53,26.16 0 bottom
U$22  [1000]  17.4,28.19 0 bottom
U$23  [MA0]  17.27,25.02 0 bottom
U$24  [SDA0]  2.92,50.29 90 top
U$25  [SCL0]  2.92,47.88 90 top
U$26  [#CSB#0]  2.79,45.21 90 top
U$27  [#4#TXO#0]  21.21,49.53 0 bottom
U$28  [110]  2.92,40.89 90 top
U$29  [#MEAS#0]  14.1,39.24 0 bottom
U$30  [#VBAT#0]  7.37,24.13 0 bottom
U$31  [ORDERING_INSTRUCTIONS]  46.99,57.15 0 top  (outside the outline)
U$32  [100]  2.92,43.31 90 top
U$33  [RTC0]  2.92,37.85 90 top
U$34  [WK10]  2.92,35.18 90 top
U$35  [WK20]  2.92,32.51 90 top
U$36  [#5#RXI#0]  21.21,46.99 0 bottom
U$37  [EN0]  2.92,25.4 90 top
U$38  [VUSB0]  2.92,27.18 90 top
U$39  [VBAT0]  2.92,21.59 90 top
U$40  [#NC#0]  21.21,52.07 0 bottom
U$41  [TX0]  19.94,48.26 90 top
U$42  [RX0]  19.94,45.72 90 top
U$43  [##RST##0]  13.34,36.83 0 bottom
U$44  [90]  19.94,43.69 90 top
U$45  [80]  19.94,40.89 90 top
U$47  [70]  19.94,38.73 90 top
U$50  [#GND#0]  21.21,21.59 0 bottom
U$51  [#3V3#0]  21.21,16.51 0 bottom
U$53  [#EN#0]  4.95,26.67 0 bottom
U$55  [GND0]  19.94,20.19 90 top
U$56  [THING_PLUS0]  16.26,34.54 0 bottom
U$57  [3V30]  19.94,15.11 90 top
U$59  [#CHG#0]  15.24,29.84 0 bottom
U$60  [#IOC6#0]  6.35,31.75 0 bottom
U$62  [#6##CSB##0]  7.49,46.99 0 bottom
U$63  [#11#LED#0]  8,41.91 0 bottom
U$64  [QWIIC_4MM]  6.6,9.4 90 top
U$65  [C60]  2.92,30.61 90 top
U$66  [#9#POCI#0]  21.21,44.45 0 bottom
U$67  [#8#PICO#0]  21.21,41.91 0 bottom
U$68  [#7#SCLK#0]  21.34,39.37 0 bottom
U$69  [#2#A2#0]  21.21,36.83 0 bottom
U$70  [#3#A3#0]  21.21,34.29 0 bottom
U$71  [#WK2#0]  6.35,34.29 0 bottom
U$72  [#WK1#0]  5.97,36.83 0 bottom
U$73  [#RTC#0]  5.97,39.37 0 bottom
U$80  [DA162000]  15.49,32.64 0 bottom
U$81  [DA162000]  6.86,35.94 0 top
U$82  [#I�C#0]  10.29,15.11 0 bottom
U$84  [#LED#0]  18.29,7.24 0 bottom
U$85  [#SHLD#0]  13.21,2.92 0 bottom

### Tracks (layer width: path | path; a pad name or v marks a point on that pad's centre or on a via)
3.3V  (via drill 0.3)
  Top 0.178: C9.1 16.89,22.61 17.65,21.84 v17.65,21.34 17.65,21.27 U7.5 | R13.2 20.32,14.86 20.32,15.24 J2.27
  Top 0.305: C1.1 9.65,15.74 v9.65,14.99 | J3.2 3.94,9.9 v3.94,9.91 | S1.1 13.94,30.45 v13.97,30.48 | R20.2 20.45,43.43 v20.57,43.31
  Bottom 0.305: LED.2 19.7,8.37 v19.68,8.38 | DA_MEAS.2 9.65,39.88 v10.16,39.37 | CH_PWR.2 22.11,10.05 v22.1,10.03 | I2C_PU.2 v8.51,14.86
  pour pwrhorz (isolate 0.305): 0,0 22.86,0 22.86,59.69 13.59,59.69 13.59,54.1 3.3,54.1 3.3,59.69 0,59.69
!RESET!
  Top 0.178: R13.1 20.43,13.97 J2.28 21.59,12.19 S2.3
  Bottom 0.178: J2.28 20.32,15.24 20.32,33.02 19.05,34.29 16.26,34.29 14.24,36.31 RST.1
!RESET!/SPI_CLK
  Top 0.178: J2.18 20.45,39.37 20.32,39.5 20.32,41.27 20.09,41.51 U1.26
  Bottom 0.178: RST.2 14.22,37.35 16.24,39.37 17.91,39.37 18.92,38.35 20.57,38.35 J2.18
A_CH2
  Top 0.178: U1.31 16.79,46.51 15.88,45.59 15.88,39.24 18.33,36.79 21.55,36.79 J2.19
A_CH3  (via drill 0.3)
  Top 0.178: U1.30 17.06,45.51 16.26,44.7 16.26,39.62 v17.4,38.48 | J2.20 20.32,35.56 v17.78,35.56
  Bottom 0.178: v17.4,38.48 17.4,35.94 v17.78,35.56
EN
  Top 0.178: U7.3 13.87,19.3 R16.1 12.56,18.79 12.45,18.67 10.79,18.67 10.29,19.18 10.29,20.19 9.65,20.83 5.84,20.83 4.57,22.1 4.57,25.65 3.56,26.67 J2.11
GND  (via drill 0.3)
  Top 0.178: R8.1 21.59,8.13 S2.1 | J5.GND 8.21,6.93 v8.26,6.99 | J5.GND2 14.65,6.77 15.12,7.24 v15.75,7.24
  Bottom 0.178: SHLD.1 v5.46,3.05
  other vias: 6.35,50.42 10.54,48.26 11.43,46.99 12.7,48.26 12.7,45.85 10.16,45.85 8.26,33.78 10.67,34.8 11.68,28.57 18.03,27.56 6.48,15.75 4.45,17.02 11.68,22.23 14.1,22.48 3.81,11.43 12.7,20.32 13.84,9.65 11.43,7.11 11.68,12.19 18.29,13.46 16.89,4.57 3.05,57.78 3.05,57.02 3.05,56.26 3.05,55.5 3.05,54.74 3.05,53.98 3.05,58.67 3.3,53.47 4.06,53.47 4.83,53.47 5.59,53.47 6.35,53.47 7.11,53.47 7.87,53.47 8.64,53.47 9.4,53.47 10.16,53.47 10.92,53.47 11.68,53.47 12.45,53.47 13.21,53.47 13.97,53.47 14.35,58.55 14.35,53.98 14.35,54.74 14.35,55.5 14.35,56.26 14.35,57.02 14.35,57.78 1.27,55.88 1.27,53.47 15.24,57.15 16.51,55.88 15.24,54.61 17.78,54.61 16.51,53.34 19.3,52.83 20.7,50.8 12.7,49.53 10.16,49.53 7.62,49.53 7.62,45.47 7.62,43.18 13.97,43.18 15.11,41.91 5.46,37.47 11.68,31.75 12.7,33.4 17.78,31.75 16.51,31.75 17.78,29.21 17.4,24 1.27,19.94 2.54,19.05 3.81,17.78 1.27,17.78 2.54,16.51 3.81,12.7 2.67,11.3 3.05,7.49 3.81,6.35 2.54,5.08 5.08,5.08 17.78,2.54 17.78,5.08 20.32,5.08 21.84,9.27 20.57,9.27 12.7,13.97 10.54,14.35 5.08,13.97 11.43,43.18 12.7,44.45 10.16,44.45 2.54,33.02 6.35,46.99 10.16,27.43 2.79,51.56 1.91,48.26 1.91,45.72 1.91,43.18 12.7,51.56 20.32,48.26 20.7,45.72 20.83,40.64 4.32,36.07 2.41,25.4 2.29,22.73 8.51,19.94 8.38,8.38 18.16,38.23 16.76,40.39 20.95,33.02
  pour Bottom (rank 2): 0,59.69 22.86,59.69 22.86,0 0,0
  pour Top (rank 2): 0,59.69 22.86,59.69 22.86,0 0,0
  pour gndvert (isolate 0.305): 0,0 22.86,0 22.86,59.69 13.59,59.69 13.59,54.1 3.43,54.1 3.43,59.69 0,59.69
GPIOA10
  Top 0.178: U1.23 15.93,38.65 15.5,39.09 15.5,39.96 13,42.46 9.19,42.46 6.66,44.98 3.8,44.98 3.26,44.45 J2.4
GPIOC6  (via drill 0.3)
  Top 0.178: U1.11 3.61,41.51 v3.59,41.53
  gndvert 0.178: J2.9 3.43,31.75 3.47,31.79 | v3.59,41.53 3.47,41.4 3.47,31.79 | J7.10 6.73,25.09 6.35,24.71 4.29,24.71 3.47,25.53 3.47,31.79
GPIOC7  (via drill 0.3)
  Top 0.178: v6.06,42.55 6.02,42.51 U1.10
  gndvert 0.178: v6.06,42.55 6.06,32.7 v5.49,32.13
  Bottom 0.178: J7.6 7.37,28.07 7.62,28.32 GPIOC7.1 6.22,31.75 5.84,32.13 v5.49,32.13
GPIOC8  (via drill 0.3)
  Top 0.178: v6.1,43.49 4.85,43.49 U1.9
  Bottom 0.178: v6.1,43.49 6.6,42.98 6.6,37.97 8.79,35.79 8.79,28.19 7.39,26.8 J7.8
HDR_RTC_WAKE2
  Top 0.178: U1.14 6.93,37 6.42,36.49 6.42,34.29 | 6.42,34.29 J2.8 | R7.2 6.99,33.72 6.42,34.29
I2C_SCL  (via drill 0.3)
  Top 0.178: U1.32 16.78,47.51 v16.76,47.5 16.09,47.5 15.33,48.26 15.33,50.46 14.78,51 2.74,51 J2.2 | v9.27,7.87 5.1,7.87 J3.4 | R10.1 8.76,9.51 v8.89,9.38
  gndvert 0.178: v16.76,47.5 16,46.74 16,8.89 14.99,7.87 v9.27,7.87 8.89,8.26 v8.89,9.38
I2C_SDA  (via drill 0.3)
  Top 0.178: U1.33 v15.88,48.51 15.88,51.69 15.49,52.07 J2.1 | v10.03,8.89 7.75,8.89 | 7.75,8.89 J3.3 | R17.1 7.75,8.89
  gndvert 0.178: v15.88,48.51 15.88,47.24 15.62,46.99 15.62,9.14 14.73,8.26 10.67,8.26 v10.03,8.89
N$1
  Top 0.178: R3.2 D4.C
N$2  (via drill 0.3)
  Top 0.178: v8.89,12.06 8.76,11.94 R10.2
  Bottom 0.178: v8.89,12.06 9.27,12.06 9.55,12.34 I2C_PU.3
N$3  (via drill 0.3)
  Top 0.178: v7.62,12.06 7.75,11.94 R17.2
  Bottom 0.178: v7.62,12.06 7.47,12.22 I2C_PU.1
N$4  (via drill 0.3)
  Top 0.178: D3.A v17.14,6.35
  Bottom 0.178: LED.1 18.03,7.24 v17.14,6.35
N$5  (via drill 0.3)
  Top 0.178: v11.26,5 11.18,5.08 J5.A6 11.18,6.6 10.92,6.86 D5.1 | v12.32,4.95 12.18,5.09 J5.B6
  Bottom 0.178: v12.32,4.95 12.28,5 v11.26,5
N$6
  Top 0.178: J5.B7 10.68,4.81 11.05,4.45 11.43,4.45 11.81,4.83 11.81,5.24 11.68,5.38 J5.A7 11.68,6.6 11.94,6.86 D5.3
N$7
  Top 0.178: R8.2 21.06,5.85 20.56,6.35 D3.C
N$8  (via drill 0.3)
  Top 0.178: v7.87,38.73 7.93,38.68 U1.15 7.93,36.65 7.21,35.93 C3.1 | v16.38,49.53 16.4,49.51 U1.34 U1.35 19.26,50.51 C2.1
  gndvert 0.178: v16.38,49.53 16,49.53 14.61,48.13 14.61,41.53 14.22,41.15 v7.87,41.15
  Bottom 0.178: v7.87,38.73 7.87,39.87 | 7.87,39.87 DA_MEAS.1 | v7.87,41.15 7.87,39.87
N$9
  Top 0.178: U3.1 16.7,24.7 16.5,24.9 16.5,28.07 15.86,28.7 13.2,28.7 12.31,29.59 D1.C
N$10  (via drill 0.3)
  Top 0.178: R6.2 v8.89,25.02
  Bottom 0.178: CHG.3 12.93,26.16 10.03,26.16 v8.89,25.02
N$11
  Top 0.178: J5.A5 10.18,7.11 R1.1
N$12
  Top 0.178: J5.B5 13.18,7.09 R4.1
N$13
  Top 0.178: D5.6 10.93,9.07 10.78,9.22 R11.1
N$14  (via drill 0.3)
  Top 0.178: v14.35,25.53 14.77,25.53 15.08,25.21 U3.5
  Bottom 0.178: v14.35,25.53 14.35,26.67 13.84,27.18 CHG.2
N$15  (via drill 0.3)
  Top 0.178: Q1.2 15.93,17.53 v16.89,17.53 17.02,17.66 D2.C | v10.79,19.56 10.8,19.56 11.06,19.3 R16.2 11.68,19.42 C8.1 10.92,20.45 10.67,20.71 MEAS.3
  pwrhorz 0.178: v10.79,19.56 15.88,19.56 16.89,18.55 v16.89,17.53
  Bottom 0.178: MEAS.1 MEAS.3
N$16
  Top 0.178: D5.4 11.93,9.65 R12.1
N$17
  Top 0.178: D1.A R2.1
N$18
  Top 0.178: R11.2 9.78,10.03 10.03,10.29 10.41,10.29 10.56,10.43 U2.1
N$19  (via drill 0.3)
  Top 0.178: R12.2 13.08,9.02 v13.21,8.89 | v11.05,12.63 11.05,11.22 U2.2
  gndvert 0.178: v13.21,8.89 13.21,11.94 12.45,12.7 11.12,12.7 v11.05,12.63
N$20  (via drill 0.3)
  Top 0.178: R14.2 7.87,25.15 v8.38,25.65
  Bottom 0.178: CHG.1 12.93,28.19 12.06,28.19 11.43,27.56 11.43,26.8 11.18,26.54 9.27,26.54 v8.38,25.65
N$21
  Top 0.178: R18.2 15.88,15.54 Q1.1
N$22
  Top 0.178: U7.1 13.94,21.91 13.21,22.64 MEAS.4
  Bottom 0.178: MEAS.2 MEAS.4
N$23  (via drill 0.3)
  Top 0.178: v10.92,27.18 v10.91,27.19 R2.2
  Bottom 0.178: CHG_LED.1 10.55,29.08 9.66,28.19 9.66,27.18 9.92,26.92 10.79,26.92 10.92,27.05 v10.92,27.18
N$24  (via drill 0.3)
  other vias: 8.26,1.27
  pour Top (isolate 0.305): 6.35,6.35 16.51,6.35 16.51,0 6.35,0
  pour Bottom (isolate 0.305): 6.35,6.35 6.35,0 16.51,0 16.51,6.35
N$26  (via drill 0.3)
  Top 0.178: U2.10 10.56,16.35 10.43,16.47 10.43,17.29 10.83,17.69 11.77,17.69 12.19,17.27 v12.19,16.76 12.19,16.74 12.06,16.6 U2.7
  pwrhorz 0.178: v19.61,11.43 13.97,11.43 13.59,11.81 13.59,16.51 13.34,16.76 v12.19,16.76
  Bottom 0.178: CH_PWR.1 v19.61,11.43
N$27  (via drill 0.3)
  other vias: 12.7,30.48
RTC_PWR_KEY  (via drill 0.3)
  Top 0.178: v6.22,49.53 6.2,49.51 U1.3 | S1.2 13.94,32.92 v13.59,33.27
  pwrhorz 0.178: v2.5,40.01 13.93,40.01 v13.97,39.97
  Bottom 0.178: J2.6 2.03,39.37 2.5,39.84 v2.5,40.01 2.5,48.35 3.68,49.53 v6.22,49.53 | v13.97,39.97 12.7,38.7 12.7,34.16 v13.59,33.27
RTC_WAKE1  (via drill 0.3)
  Top 0.178: U1.4 4.79,48.55 v3.43,48.55 | R5.2 v5.33,33.77 v5.33,33.78
  Bottom 0.178: 3.05,36.83 3.05,48.17 v3.43,48.55 | 3.05,36.83 4.83,36.83 5.33,36.32 v5.33,33.78 | 3.05,36.83 J2.7
SPI_CSB  (via drill 0.3)
  Top 0.178: v16.8,42.55 16.84,42.51 U1.27 19.73,42.51 R20.1
  pwrhorz 0.178: v8.89,45.97 2.54,45.97 1.52,46.99 J2.3
  Bottom 0.178: v16.8,42.55 9.44,42.55 8.89,43.09 v8.89,45.97
SPI_PICO  (via drill 0.3)
  Top 0.178: v19.81,40.51 U1.25
  Bottom 0.178: J2.17 20.57,41.91 19.81,41.15 v19.81,40.51
SPI_POCI  (via drill 0.3)
  Top 0.178: v19.3,39.5 18.04,39.5 U1.24
  Bottom 0.178: J2.16 20.45,44.45 19.3,43.31 v19.3,39.5
STAT_LED
  Top 0.178: J2.5 1.4,42.04 12.95,42.04 14.93,40.06 U1.22 14.93,36.24 14.04,35.35 12.11,35.35 11.67,34.91 D4.A
TCLK  (via drill 0.3)
  Top 0.178: U1.8 5.02,44.51 5.08,44.45 v6.35,44.45
  gndvert 0.178: J7.4 6.11,29.96 6.11,32.02 6.6,32.51 6.6,44.2 v6.35,44.45
TMS  (via drill 0.3)
  Top 0.178: v6.82,45.47 4.87,45.47 U1.7
  gndvert 0.178: v6.82,45.47 6.82,45.12 6.99,44.96 6.99,35.16 | J7.2 6.99,30.86 6.99,35.16 | v8,35.16 6.99,35.16
  Bottom 0.178: v8,35.16 8,34.67 TMS.1
U0RXI  (via drill 0.3)
  Top 0.178: U1.13 v4.83,35.06 v4.83,35.05 | v11.56,17.14 U2.8
  Bottom 0.178: v4.83,35.05 4.83,34.92 4.57,34.67 4.57,21.46 8.89,17.14 v11.56,17.14
U0TXO  (via drill 0.3)
  Top 0.178: U1.12 3.93,40.51 3.68,40.26 3.68,35.43 v4.06,35.05 | U2.9 v11.06,16.63 v11.05,16.64
  Bottom 0.178: v4.06,35.05 4.06,20.95 8.38,16.64 v11.05,16.64
U1RXI
  Top 0.178: U1.28 18.92,43.51 20.07,44.65 20.07,46.48 20.57,46.99 J2.15
U1TXO
  Top 0.178: U1.29 18.92,44.51 19.68,45.27 19.68,49.15 20.07,49.53 J2.14
V_BATT  (via drill 0.3)
  Top 0.178: 19.5,26.6 C10.1
  Top 0.305: U3.3 v18.8,26.6 19.5,26.6 | J2.12 3.3,24.13 4.06,23.37 4.06,19.43 4.71,18.78 J4.2 9.69,18.78 10.27,18.2 13.76,18.2 | Q1.3 13.76,18.2 | 13.76,18.2 17.18,18.2 18.31,19.33 18.31,22.02 v18.06,22.28
  gndvert 0.305: v18.8,26.6 18.8,25.46 18.06,24.72 v18.06,22.28
V_USB  (via drill 0.3)
  Top 0.178: R15.2 | 15.11,26.63 U3.4
  Top 0.305: C7.1 15.11,26.63 | J2.10 2.79,29.21 5.08,31.5 7.49,31.5 8.13,30.86 8.13,27.18 v8.45,26.86 8.7,26.6 U3.4 15.81,26.6 16.07,26.35 16.07,24.07 16.76,23.37 17.78,23.37 18.8,22.35 18.8,17.27 17.78,16.26 D2.A 17.78,14.6 R15.2 | R18.1 14.88,13.45 14.92,13.4 | 14.92,13.4 14.99,13.34 17.14,13.34 17.4,13.59 R15.2 | J5.VBUS1 8.98,5.36 9.17,5.17 9.17,4.67 9.78,4.06 13.08,4.06 13.69,4.67 13.69,5.17 13.88,5.36 J5.VBUS2 13.88,6.77 14.52,7.41 14.52,10.33 | D5.5 11.43,10.09 11.68,10.33 14.52,10.33 | 14.52,10.33 14.52,12.99 14.92,13.4
  Bottom 0.305: CHG_LED.2 9.51,28.83 9.26,28.57 9.26,27.67 v8.45,26.86

### Text on the board
Top: 1
gndvert: 2
pwrhorz: 3
Bottom: 4 | v11
tPlace: + | -
Measures: Units in inches
tDocu: Four Layers | Priyanka Makin